# EAGLE schematic circuit (EAGLE 9.7.0)
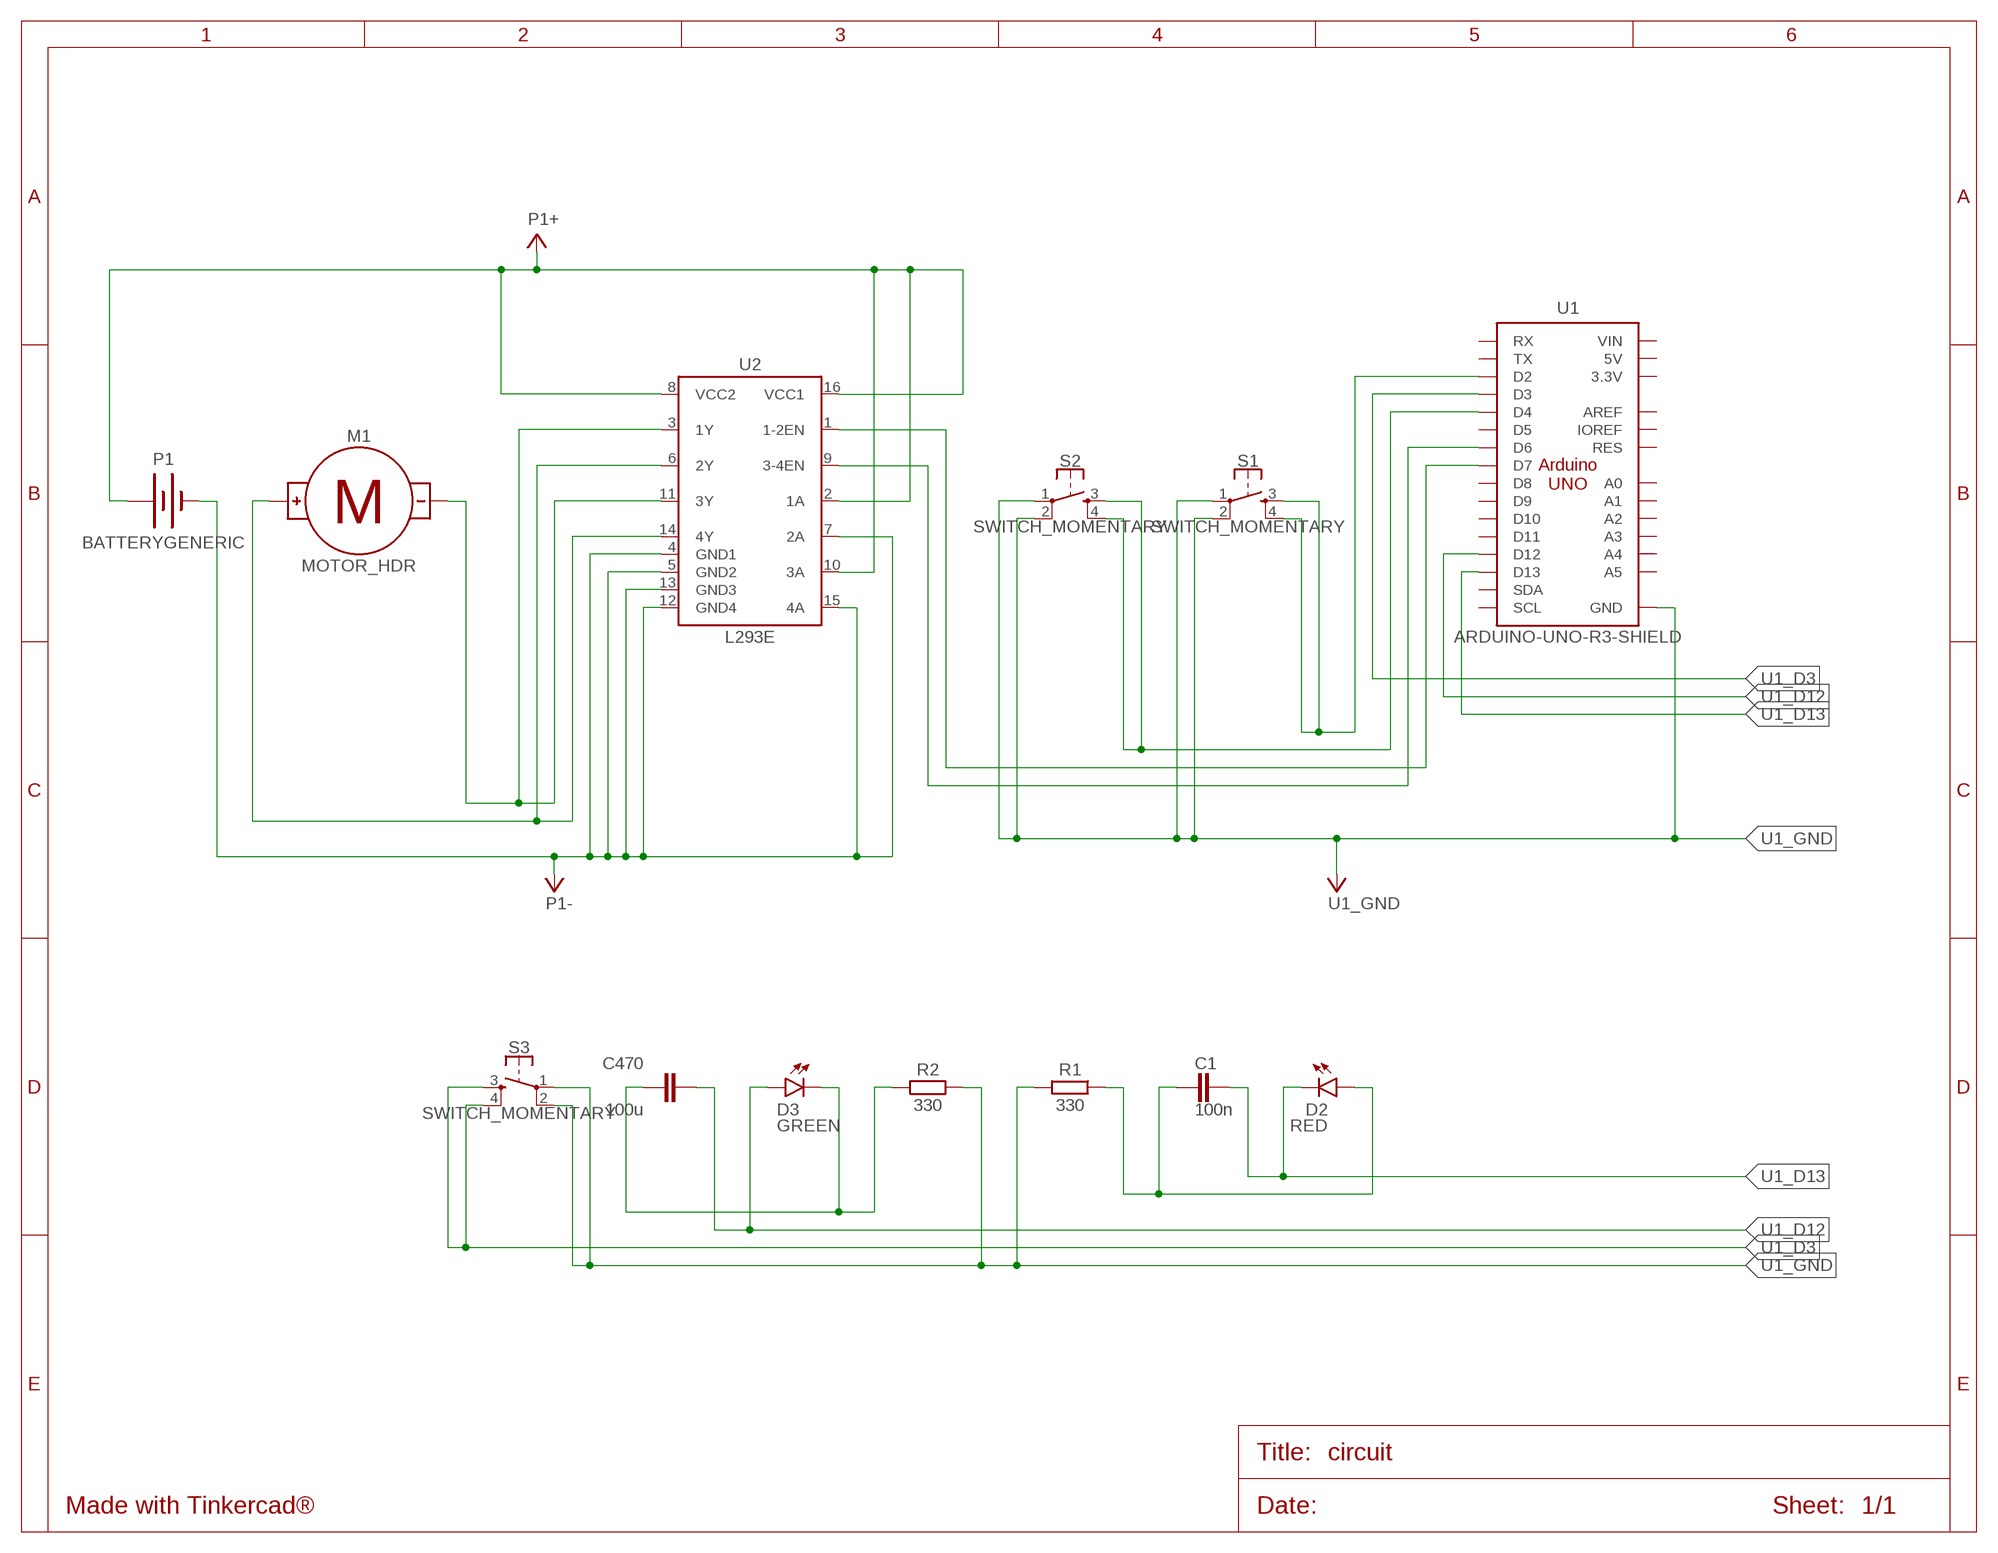
[diagram p0: schematic, sheet 1]

## Parts
C1  100n  CAPACITORCERAMIC-2.54MM  [CAP-THRU-2.54MM]
C470  100u  CAPACITORCERAMIC-2.54MM  [CAP-THRU-2.54MM]
D2  RED  LED_RADIAL_RED  [LEDRD254W60D565H860B]
D3  GREEN  LED_RADIAL_GREEN  [LEDRD254W60D565H860B_G]
M1  MOTOR_HDR  [MOTOR]
P1  BATTERYGENERIC  [BATTERY-GENERIC]
R1  330  RESISTOR_AXIAL-10.16MM-PITCH  [RESAD1016W63L850D250B]
R2  330  RESISTOR_AXIAL-10.16MM-PITCH  [RESAD1016W63L850D250B]
S1  SWITCH_MOMENTARY  [SWITCH-MOMENTARY-PTH-6.5MM]
S2  SWITCH_MOMENTARY  [SWITCH-MOMENTARY-PTH-6.5MM]
S3  SWITCH_MOMENTARY  [SWITCH-MOMENTARY-PTH-6.5MM]
U1  ARDUINO-UNO-R3-SHIELD  [ARDUINO-UNO-R3-SHIELD]
U2  L293E  [DIP762W53P254L1969H508Q16B]

## Nets
D2_A: C1.2 D2.1(A) R1.1
D3_C: C470.1 D3.2(C) R2.1
M1_+: M1.+ U2.6(2Y) U2.14(4Y)
M1_-: M1.- U2.3(1Y) U2.11(3Y)
P1+: P1.+ U2.2(1A) U2.8(VCC2) U2.10(3A) U2.16(VCC1)
P1-: P1.- U2.4(GND1) U2.5(GND2) U2.7(2A) U2.12(GND4) U2.13(GND3) U2.15(4A)
U1_D2: S1.3 S1.4 U1.D2
U1_D3: S3.3 S3.4 U1.D3
U1_D4: S2.3 S2.4 U1.D4
U1_D6: U1.D6 U2.9(3-4EN)
U1_D7: U1.D7 U2.1(1-2EN)
U1_D12: C470.2 D3.1(A) U1.D12
U1_D13: C1.1 D2.2(C) U1.D13
U1_GND: R1.2 R2.2 S1.1 S1.2 S2.1 S2.2 S3.1 S3.2 U1.GND@0(GND) U1.GND@1(GND) U1.GND@2(GND)
Unconnected: U1.3.3V U1.5V U1.A0 U1.A1 U1.A2 U1.A3 U1.A4 U1.A5 U1.AREF U1.D5 U1.D8 U1.D9 U1.D10 U1.D11 U1.IOREF U1.RES U1.RX U1.SCL U1.SDA U1.TX U1.VIN

## Library data of the parts
C1 C470 = Tinkercad:CAPACITOR: Capacitor - Generic
D2 = Tinkercad:LED_RADIAL: LED - Generic; CATEGORY: Opto-Electronic; SUB-CATEGORY: LED; VALUE: LED_RED
D3 = Tinkercad:LED_RADIAL: LED - Generic; CATEGORY: Opto-Electronic; SUB-CATEGORY: LED; VALUE: LED_GREEN
M1 = Tinkercad:MOTOR
P1 = Tinkercad:BATTERY
R1 R2 = Tinkercad:RESISTOR: Resistor Fixed - Generic
S1-S3 = Tinkercad:SWITCH_MOMENTARY
U1 = Tinkercad:ARDUINO-UNO-R3-SHIELD
U2 = Tinkercad:L293E: L293D H-bridge motor driver Datasheet <https://www.ti.com/lit/ds/symlink/l293.pdf>